# EAGLE design smart hub v2 (EAGLE 9.6.2)
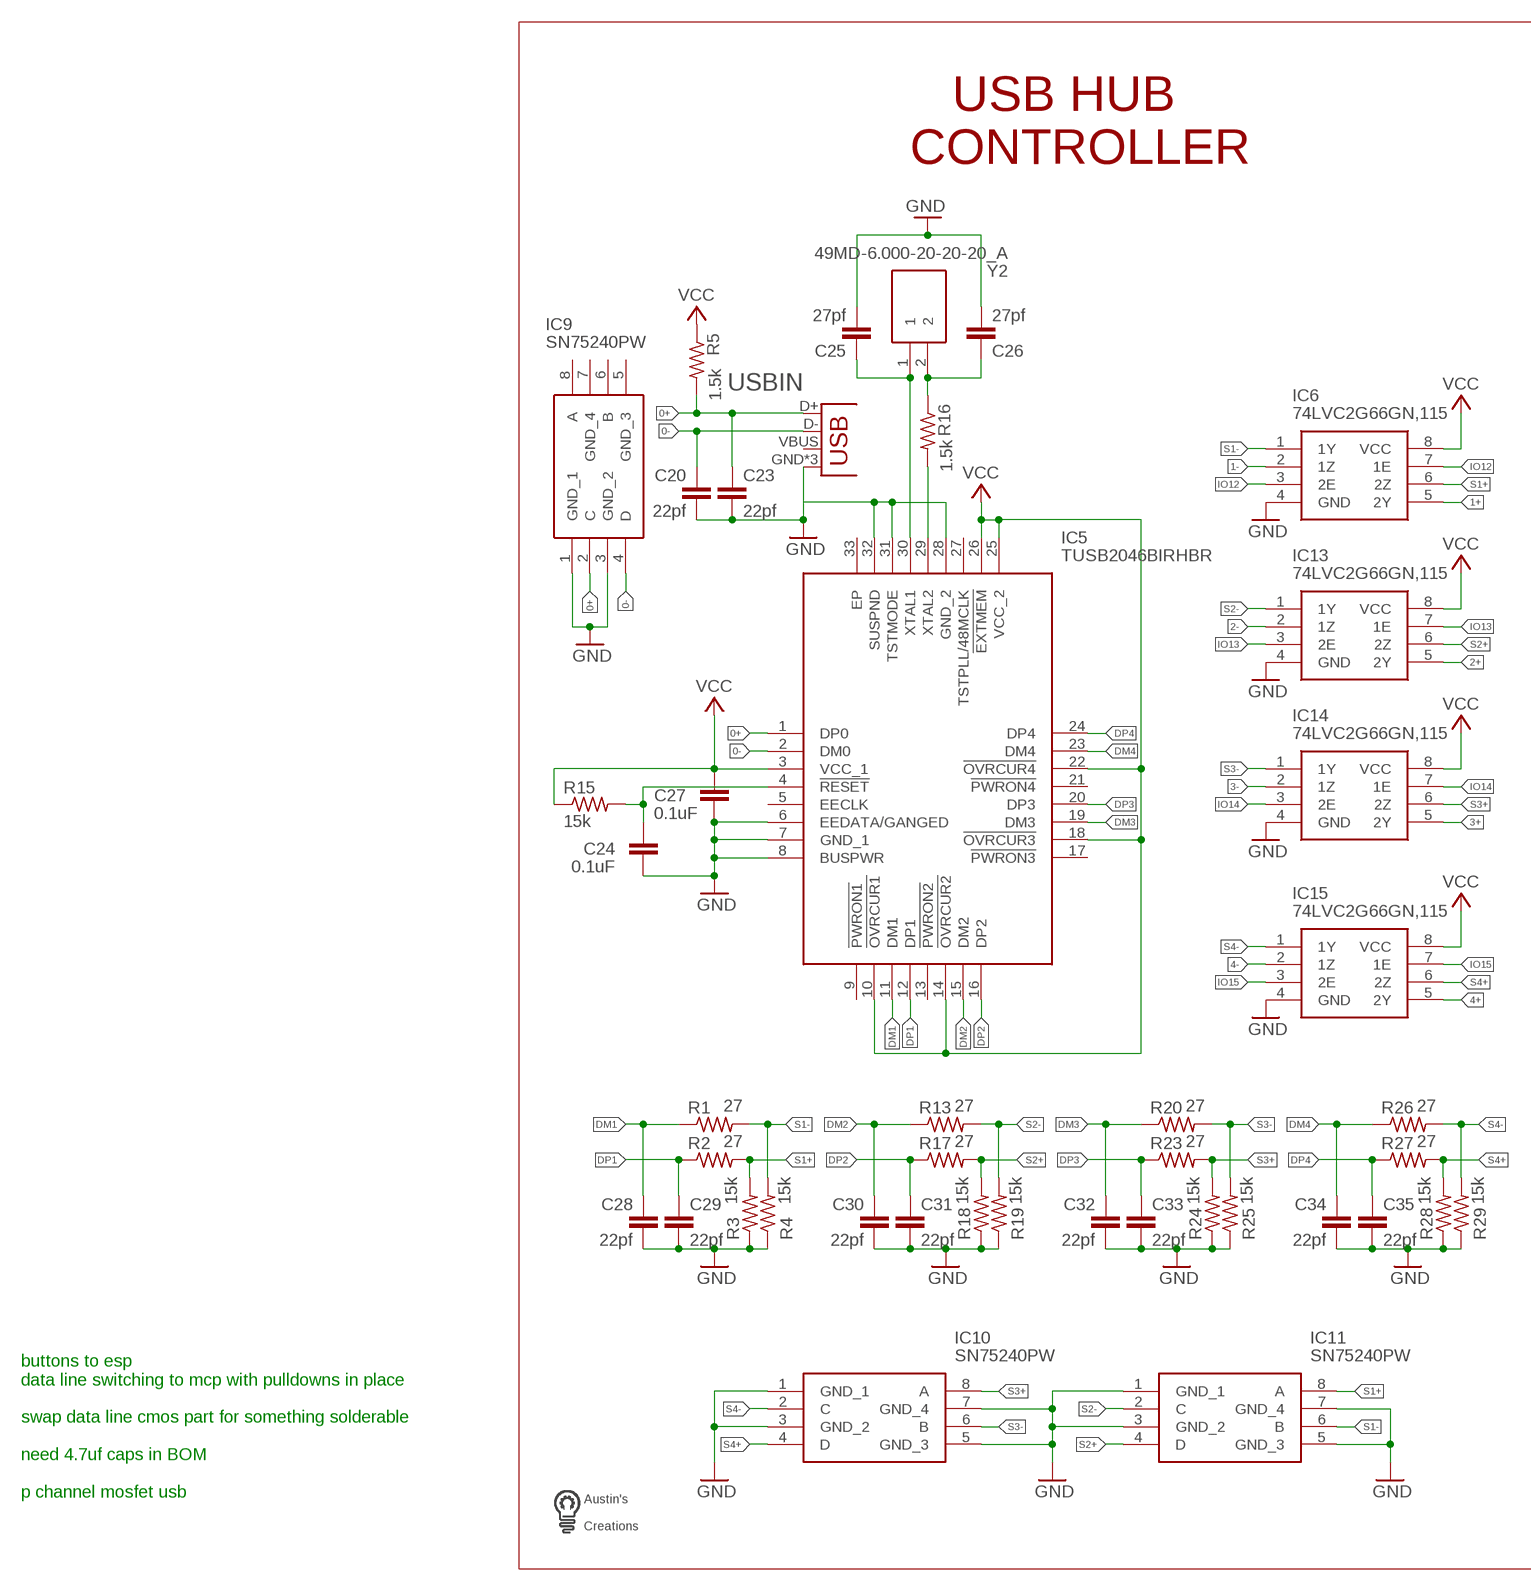
[diagram p0: schematic, sheet 1, part 1 of 2]
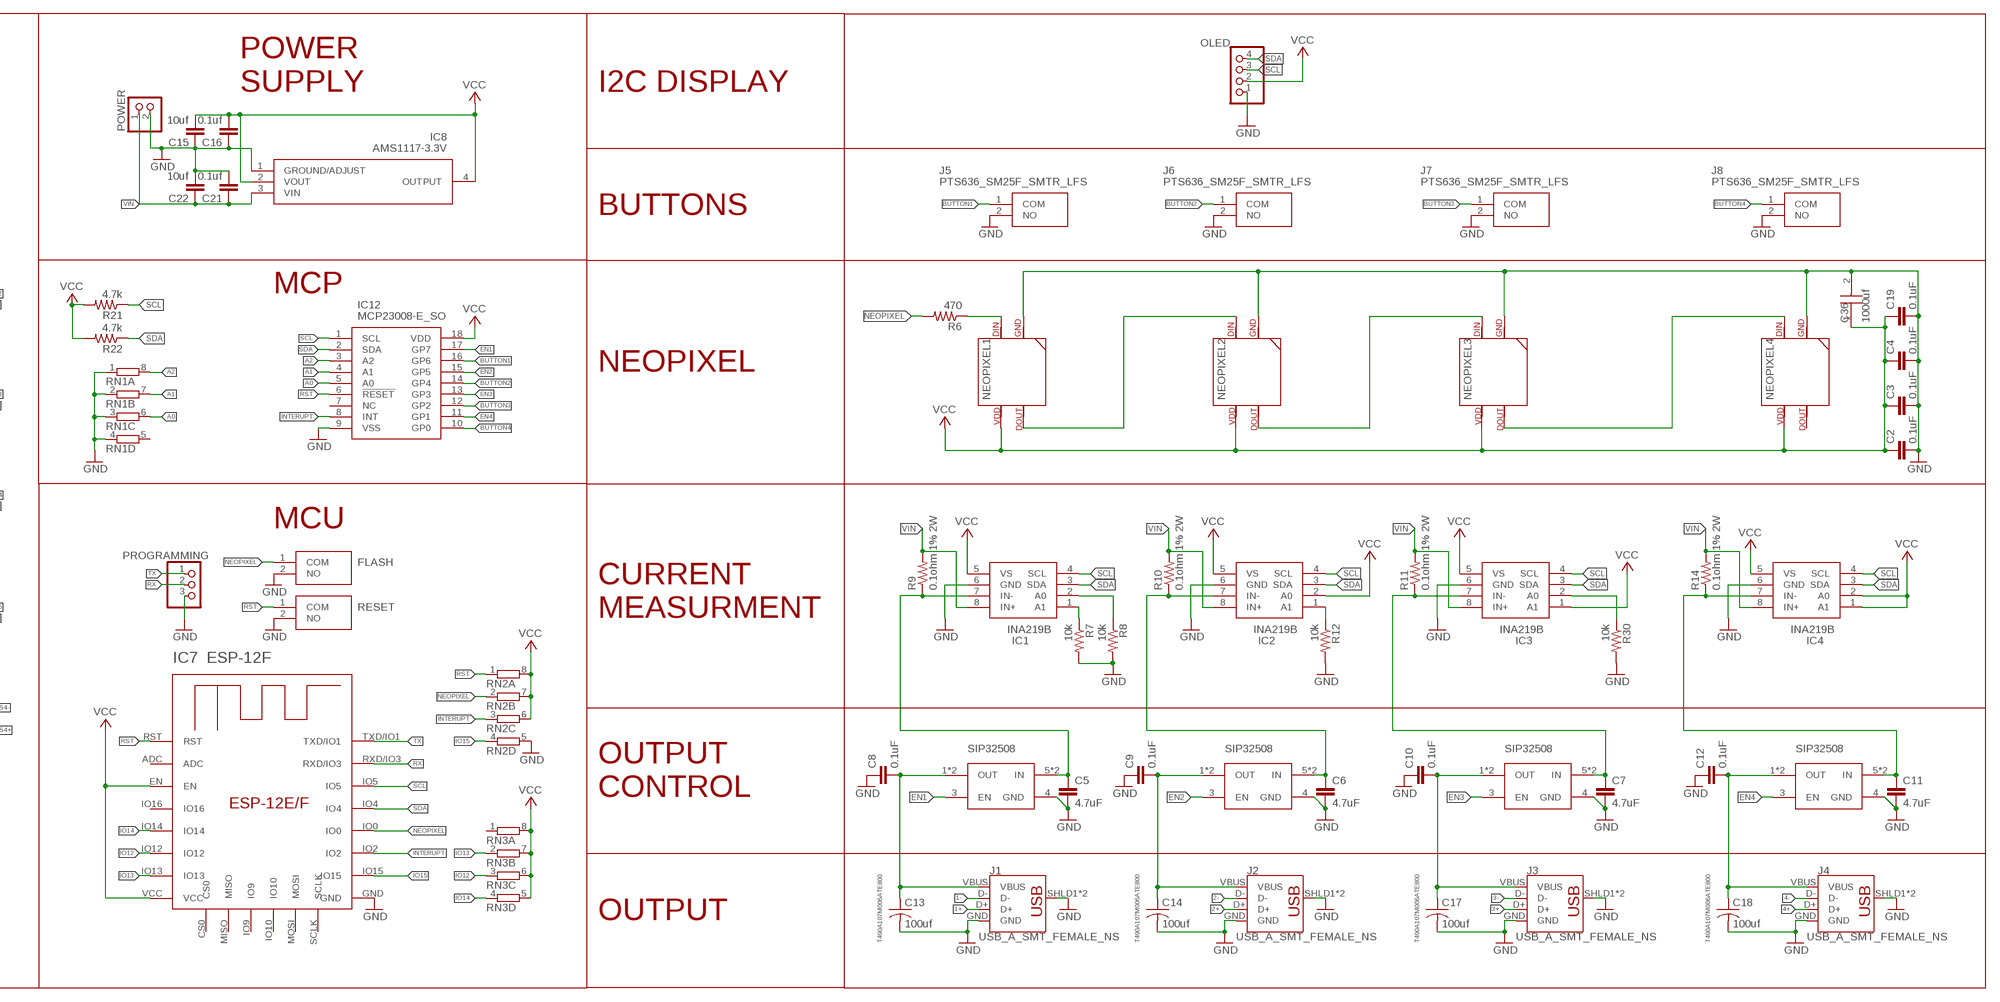
[diagram p1: schematic, sheet 1, part 2 of 2]

## Parts
C2  0.1uF  C-EUC0603  [C0603]
C3  0.1uF  C-EUC0603  [C0603]
C4  0.1uF  C-EUC0603  [C0603]
C5  4.7uF  C-EUC0603  [C0603]
C6  4.7uF  C-EUC0603  [C0603]
C7  4.7uF  C-EUC0603  [C0603]
C8  0.1uF  C-EUC0603  [C0603]
C9  0.1uF  C-EUC0603  [C0603]
C10  0.1uF  C-EUC0603  [C0603]
C11  4.7uF  C-EUC0603  [C0603]
C12  0.1uF  C-EUC0603  [C0603]
C13  100uf  C-USC1206  [C1206]
C14  100uf  C-USC1206  [C1206]
C15  10uf  C-EUC0603  [C0603]
C16  0.1uf  C-EUC0603  [C0603]
C17  100uf  C-USC1206  [C1206]
C18  100uf  C-USC1206  [C1206]
C19  0.1uF  C-EUC0603  [C0603]
C20  22pf  C-EUC0603  [C0603]
C21  0.1uf  C-EUC0603  [C0603]
C22  10uf  C-EUC0603  [C0603]
C23  22pf  C-EUC0603  [C0603]
C24  0.1uF  C-EUC0603  [C0603]
C25  27pf  C-EUC0603  [C0603]
C26  27pf  C-EUC0603  [C0603]
C27  0.1uF  C-EUC0603  [C0603]
C28  22pf  C-EUC0603  [C0603]
C29  22pf  C-EUC0603  [C0603]
C30  22pf  C-EUC0603  [C0603]
C31  22pf  C-EUC0603  [C0603]
C32  22pf  C-EUC0603  [C0603]
C33  22pf  C-EUC0603  [C0603]
C34  22pf  C-EUC0603  [C0603]
C35  22pf  C-EUC0603  [C0603]
C36  1000uf  EEE-0JA102P  [CAPAE1030X1050N]
FLASH  PTS636_SM25F_SMTR_LFS  [PTS636SM25FSMTRLFS]
IC1  INA219B  INA219AIDR  [SOIC127P600X175-8N]
IC2  INA219B  INA219AIDR  [SOIC127P600X175-8N]
IC3  INA219B  INA219AIDR  [SOIC127P600X175-8N]
IC4  INA219B  INA219AIDR  [SOIC127P600X175-8N]
IC5  TUSB2046BIRHBR  [QFN50P500X500X100-33N]
IC6  74LVC2G66GN,115  [74AUP1G74GN115]
IC7  ESP-12F  ESP-12E/F  [ESP-12E]
IC8  AMS1117-3.3V  [SOT229P700X180-4N]
IC9  SN75240PW  [SOP65P640X120-8N]
IC10  SN75240PW  [SOP65P640X120-8N]
IC11  SN75240PW  [SOP65P640X120-8N]
IC12  MCP23008-E_SO  [SOIC127P1030X265-18N]
IC13  74LVC2G66GN,115  [74AUP1G74GN115]
IC14  74LVC2G66GN,115  [74AUP1G74GN115]
IC15  74LVC2G66GN,115  [74AUP1G74GN115]
J1  USB_A_SMT_FEMALE_NS  [USB-A-S-NOSILK-FEMALE]
J2  USB_A_SMT_FEMALE_NS  [USB-A-S-NOSILK-FEMALE]
J3  USB_A_SMT_FEMALE_NS  [USB-A-S-NOSILK-FEMALE]
J4  USB_A_SMT_FEMALE_NS  [USB-A-S-NOSILK-FEMALE]
J5  PTS636_SM25F_SMTR_LFS  [PTS636SM25FSMTRLFS]
J6  PTS636_SM25F_SMTR_LFS  [PTS636SM25FSMTRLFS]
J7  PTS636_SM25F_SMTR_LFS  [PTS636SM25FSMTRLFS]
J8  PTS636_SM25F_SMTR_LFS  [PTS636SM25FSMTRLFS]
NEOPIXEL1  SK6812NEOPIXEL5050  [SK6812]
NEOPIXEL2  SK6812NEOPIXEL5050  [SK6812]
NEOPIXEL3  SK6812NEOPIXEL5050  [SK6812]
NEOPIXEL4  SK6812NEOPIXEL5050  [SK6812]
OLED  PINHD-1X4  [1X04]
POWER  PINHD-1X2  [1X02]
PROGRAMMING  PINHD-1X3  [1X03]
R1  27  R-US_R0603  [R0603]
R2  27  R-US_R0603  [R0603]
R3  15k  R-US_R0603  [R0603]
R4  15k  R-US_R0603  [R0603]
R5  1.5k  R-US_R0603  [R0603]
R6  470  R-US_R0603  [R0603]
R7  10k  R-US_R0603  [R0603]
R8  10k  R-US_R0603  [R0603]
R9  0.1ohm 1% 2W  R-US_R2512W  [R2512W]
R10  0.1ohm 1% 2W  R-US_R2512W  [R2512W]
R11  0.1ohm 1% 2W  R-US_R2512W  [R2512W]
R12  10k  R-US_R0603  [R0603]
R13  27  R-US_R0603  [R0603]
R14  0.1ohm 1% 2W  R-US_R2512W  [R2512W]
R15  15k  R-US_R0603  [R0603]
R16  1.5k  R-US_R0603  [R0603]
R17  27  R-US_R0603  [R0603]
R18  15k  R-US_R0603  [R0603]
R19  15k  R-US_R0603  [R0603]
R20  27  R-US_R0603  [R0603]
R21  4.7k  R-US_R0603  [R0603]
R22  4.7k  R-US_R0603  [R0603]
R23  27  R-US_R0603  [R0603]
R24  15k  R-US_R0603  [R0603]
R25  15k  R-US_R0603  [R0603]
R26  27  R-US_R0603  [R0603]
R27  27  R-US_R0603  [R0603]
R28  15k  R-US_R0603  [R0603]
R29  15k  R-US_R0603  [R0603]
R30  10k  R-US_R0603  [R0603]
RESET  PTS636_SM25F_SMTR_LFS  [PTS636SM25FSMTRLFS]
RN1  4R-N0603-ARC  [0603-ARC]
RN2  4R-N0603-ARC  [0603-ARC]
RN3  4R-N0603-ARC  [0603-ARC]
U$1  LOGOMASSIVE  [LOGOMASSIVE]
U$3  SIP32508  [SOT23-6]
U$4  SIP32508  [SOT23-6]
U$5  SIP32508  [SOT23-6]
U$8  SIP32508  [SOT23-6]
USBIN  USB-MICROB  [USB-MICROB]
Y2  49MD-6.000-20-20-20_A  [49MD6000202020A]

## Nets
0+: C23.1 IC5.1(DP0) IC9.2(C) R5.2 USBIN.D+
0-: C20.1 IC5.2(DM0) IC9.4(D) USBIN.D-
1+: IC6.5(2Y) J1.D+
1-: IC6.2(1Z) J1.D-
2+: IC13.5(2Y) J2.D+
2-: IC13.2(1Z) J2.D-
3+: IC14.5(2Y) J3.D+
3-: IC14.2(1Z) J3.D-
4+: IC15.5(2Y) J4.D+
4-: IC15.2(1Z) J4.D-
A0: IC12.5(A0) RN1.6
A1: IC12.4(A1) RN1.7
A2: IC12.3(A2) RN1.8
BUTTON1: IC12.16(GP6) J5.1(COM)
BUTTON2: IC12.14(GP4) J6.1(COM)
BUTTON3: IC12.12(GP2) J7.1(COM)
BUTTON4: IC12.10(GP0) J8.1(COM)
DM1: C28.1 IC5.11(DM1) R1.1
DM2: C30.1 IC5.15(DM2) R13.1
DM3: C32.1 IC5.19(DM3) R20.1
DM4: C34.1 IC5.23(DM4) R26.1
DP1: C29.1 IC5.12(DP1) R2.1
DP2: C31.1 IC5.16(DP2) R17.1
DP3: C33.1 IC5.20(DP3) R23.1
DP4: C35.1 IC5.24(DP4) R27.1
EN1: IC12.17(GP7) U$3.3(EN)
EN2: IC12.15(GP5) U$4.3(EN)
EN3: IC12.13(GP3) U$5.3(EN)
EN4: IC12.11(GP1) U$8.3(EN)
GND: C2.2 C3.2 C4.2 C5.2 C6.2 C7.2 C8.1 C9.1 C10.1 C11.2 C12.1 C13.2 C14.2 C15.1 C16.1 C17.2 C18.2 C19.2 C20.2 C21.2 C22.2 C23.2 C24.2 C25.2 C26.2 C27.2 C28.2 C29.2 C30.2 C31.2 C32.2 C33.2 C34.2 C35.2 C36.2(-) FLASH.2(NO) IC1.6(GND) IC2.6(GND) IC3.6(GND) IC4.6(GND) IC5.6(EEDATA/GANGED) IC5.7(GND_1) IC5.8(BUSPWR) IC5.28(GND_2) IC5.31(TSTMODE) IC5.32(SUSPND) IC6.4(GND) IC7.GND IC8.1(GROUND/ADJUST) IC9.1(GND_1) IC9.3(GND_2) IC10.1(GND_1) IC10.3(GND_2) IC10.5(GND_3) IC10.7(GND_4) IC11.1(GND_1) IC11.3(GND_2) IC11.5(GND_3) IC11.7(GND_4) IC12.9(VSS) IC13.4(GND) IC14.4(GND) IC15.4(GND) J1.GND J1.SHLD1(SHIELD) J1.SHLD2(SHIELD) J2.GND J2.SHLD1(SHIELD) J2.SHLD2(SHIELD) J3.GND J3.SHLD1(SHIELD) J3.SHLD2(SHIELD) J4.GND J4.SHLD1(SHIELD) J4.SHLD2(SHIELD) J5.2(NO) J6.2(NO) J7.2(NO) J8.2(NO) NEOPIXEL1.3(GND) NEOPIXEL2.3(GND) NEOPIXEL3.3(GND) NEOPIXEL4.3(GND) OLED.1 POWER.2 PROGRAMMING.3 R3.1 R4.1 R7.2 R8.2 R12.2 R18.1 R19.1 R24.1 R25.1 R28.1 R29.1 R30.2 RESET.2(NO) RN1.1 RN1.2 RN1.3 RN1.4 RN2.5 U$3.4(GND) U$4.4(GND) U$5.4(GND) U$8.4(GND) USBIN.GND USBIN.MT1(GND) USBIN.MT2(GND)
INTERUPT: IC7.IO2 IC12.8(INT) RN2.3
IO12: IC6.3(2E) IC6.7(1E) IC7.IO12 RN3.3
IO13: IC7.IO13 IC13.3(2E) IC13.7(1E) RN3.2
IO14: IC7.IO14 IC14.3(2E) IC14.7(1E) RN3.4
IO15: IC7.IO15 IC15.3(2E) IC15.7(1E) RN2.4
N$3: C25.1 IC5.30(XTAL1) Y2.1
N$4: C24.1 IC5.4(!RESET) R15.2
N$5: C26.1 R16.1 Y2.2
N$7: IC5.29(XTAL2) R16.2
N$9: NEOPIXEL1.2(DOUT) NEOPIXEL2.4(DIN)
N$10: NEOPIXEL2.2(DOUT) NEOPIXEL3.4(DIN)
N$11: C5.1 IC1.7(IN-) R9.1 U$3.5(IN) U$3.6(IN)
N$12: C6.1 IC2.7(IN-) R10.1 U$4.5(IN) U$4.6(IN)
N$13: IC3.2(A0) R30.1
N$14: IC2.1(A1) R12.1
N$15: IC1.1(A1) R7.1
N$16: IC1.2(A0) R8.1
N$17: NEOPIXEL1.4(DIN) R6.1
N$19: C7.1 IC3.7(IN-) R11.1 U$5.5(IN) U$5.6(IN)
N$20: NEOPIXEL3.2(DOUT) NEOPIXEL4.4(DIN)
N$21: C10.2 C17.1 J3.VBUS U$5.1(OUT) U$5.2(OUT)
N$22: C9.2 C14.1 J2.VBUS U$4.1(OUT) U$4.2(OUT)
N$25: C11.1 IC4.7(IN-) R14.1 U$8.5(IN) U$8.6(IN)
N$26: C12.2 C18.1 J4.VBUS U$8.1(OUT) U$8.2(OUT)
N$41: C8.2 C13.1 J1.VBUS U$3.1(OUT) U$3.2(OUT)
NEOPIXEL: FLASH.1(COM) IC7.IO0 R6.2 RN2.2
RST: IC7.RST IC12.6(!RESET) RESET.1(COM) RN2.1
RX: IC7.RXD/IO3 PROGRAMMING.2
S1+: IC6.6(2Z) IC11.8(A) R2.2 R3.2
S1-: IC6.1(1Y) IC11.6(B) R1.2 R4.2
S2+: IC11.4(D) IC13.6(2Z) R17.2 R18.2
S2-: IC11.2(C) IC13.1(1Y) R13.2 R19.2
S3+: IC10.8(A) IC14.6(2Z) R23.2 R24.2
S3-: IC10.6(B) IC14.1(1Y) R20.2 R25.2
S4+: IC10.4(D) IC15.6(2Z) R27.2 R28.2
S4-: IC10.2(C) IC15.1(1Y) R26.2 R29.2
SCL: IC1.4(SCL) IC2.4(SCL) IC3.4(SCL) IC4.4(SCL) IC7.IO5 IC12.1(SCL) OLED.3 R21.1
SDA: IC1.3(SDA) IC2.3(SDA) IC3.3(SDA) IC4.3(SDA) IC7.IO4 IC12.2(SDA) OLED.4 R22.1
TX: IC7.TXD/IO1 PROGRAMMING.1
VCC: C2.1 C3.1 C4.1 C15.2 C16.2 C19.1 C27.1 C36.1(+) IC1.5(VS) IC2.2(A0) IC2.5(VS) IC3.1(A1) IC3.5(VS) IC4.1(A1) IC4.2(A0) IC4.5(VS) IC5.3(VCC_1) IC5.10(!OVRCUR1) IC5.14(!OVRCUR2) IC5.18(!OVRCUR3) IC5.22(!OVRCUR4) IC5.25(VCC_2) IC5.26(!EXTMEM) IC6.8(VCC) IC7.EN IC7.VCC IC8.2(VOUT) IC8.4(OUTPUT) IC12.18(VDD) IC13.8(VCC) IC14.8(VCC) IC15.8(VCC) NEOPIXEL1.1(VDD) NEOPIXEL2.1(VDD) NEOPIXEL3.1(VDD) NEOPIXEL4.1(VDD) OLED.2 R5.1 R15.1 R21.2 R22.2 RN2.6 RN2.7 RN2.8 RN3.5 RN3.6 RN3.7 RN3.8
VIN: C21.1 C22.1 IC1.8(IN+) IC2.8(IN+) IC3.8(IN+) IC4.8(IN+) IC8.3(VIN) POWER.1 R9.2 R10.2 R11.2 R14.2
Unconnected: IC5.5(EECLK) IC5.9(!PWRON1) IC5.13(!PWRON2) IC5.17(!PWRON3) IC5.21(!PWRON4) IC5.27(TSTPLL/48MCLK) IC5.33(EP) IC7.ADC IC7.CS0 IC7.IO9 IC7.IO10 IC7.IO16 IC7.MISO IC7.MOSI IC7.SCLK IC9.5(GND_3) IC9.6(B) IC9.7(GND_4) IC9.8(A) IC12.7(NC) NEOPIXEL4.2(DOUT) RN1.5 RN3.1 USBIN.VBUS

## Notes on the sheet
- POWER
  SUPPLY
- I2C DISPLAY
- USB HUB
  CONTROLLER
- BUTTONS
- MCP
- NEOPIXEL
- MCU
- CURRENT
  MEASURMENT
- OUTPUT
  CONTROL
- OUTPUT
- buttons to esp
  data line switching to mcp with pulldowns in place
  
  swap data line cmos part for something solderable
  
  need 4.7uf caps in BOM
  
  p channel mosfet usb
- T490A107M006ATE800 | T490A107M006ATE800 | T490A107M006ATE800 | T490A107M006ATE800

## Library data of the parts
C2-C12 C15 C16 C19-C35 = rcl:C-EU: CAPACITOR, European symbol; SPICEPREFIX: C
C13 C14 C17 C18 = custom parts:C-US: CAPACITOR, American symbol; SPICEPREFIX: C
C36 = SamacSys_Parts:EEE-0JA102P: Panasonic 1000uF 6.3 V Aluminium Electrolytic Capacitor G, S(V) Series 2000h 10 x 10.2mm Source: Datasheet <https://componentsearchengine.com/Datasheets/1/EEE-0JA102P.pdf>; DESCRIPTION: Panasonic 1000uF 6.3 V Aluminium Electrolytic Capacitor G, S(V) Series 2000h 10 x 10.2mm; HEIGHT: 10.5mm; MANUFACTURER_NAME: Panasonic; MANUFACTURER_PART_NUMBER: EEE-0JA102P; MOUSER_PART_NUMBER: 667-EEE-0JA102P; MOUSER_PRICE-STOCK: https://www.mouser.com/Search/Refine.aspx?Keyword=667-EEE-0JA102P
FLASH J5-J8 RESET = SamacSys_Parts:PTS636_SM25F_SMTR_LFS: Tactile Switches Tact 50mA 12VDC, 6.0x3.5, 2.5mm H, 180gf, F leads, No ground pin, White Actuator Source: Datasheet <https://ms.componentsearchengine.com/Datasheets/1/PTS636 SM25F SMTR LFS.pdf>; ARROW_PART_NUMBER: PTS636 SM25F SMTR LFS; ARROW_PRICE-STOCK: https://www.arrow.com/en/products/pts636-sm25f-smtr-lfs/ck; DESCRIPTION: Tactile Switches Tact 50mA 12VDC, 6.0x3.5, 2.5mm H, 180gf, F leads, No ground pin, White Actuator; HEIGHT: 2.7mm; MANUFACTURER_NAME: C & K COMPONENTS; MANUFACTURER_PART_NUMBER: PTS636 SM25F SMTR LFS; MOUSER_PART_NUMBER: 611-PTS636SM25FSMTRL; MOUSER_PRICE-STOCK: https://www.mouser.co.uk/ProductDetail/CK/PTS636-SM25F-SMTR-LFS?qs=vLWxofP3U2wcBTQSwfMFOw%3D%3D
IC1-IC4 = SamacSys_Parts:INA219AIDR: 26-V, Bidirectional, Zero-Drift, High-Side, I2C Out Current/Power Monitor Source: Datasheet <http://www.ti.com/lit/gpn/ina219>; ARROW_PART_NUMBER: INA219AIDR; ARROW_PRICE-STOCK: https://www.arrow.com/en/products/ina219aidr/texas-instruments; DESCRIPTION: 26-V, Bidirectional, Zero-Drift, High-Side, I2C Out Current/Power Monitor; HEIGHT: 1.75mm; MANUFACTURER_NAME: Texas Instruments; MANUFACTURER_PART_NUMBER: INA219AIDR; MOUSER_PART_NUMBER: 595-INA219AIDR; MOUSER_PRICE-STOCK: https://www.mouser.co.uk/ProductDetail/Texas-Instruments/INA219AIDR?qs=XGzIaZb%2FFYIE5YcOHTnKDA%3D%3D
IC5 = SamacSys_Parts:TUSB2046BIRHBR: 4-Port USB 2.0 12 Mbps USB Full-Speed Hub Source: Datasheet <http://www.ti.com/lit/gpn/tusb2046b>; DESCRIPTION: 4-Port USB 2.0 12 Mbps USB Full-Speed Hub; HEIGHT: 1mm; MANUFACTURER_NAME: Texas Instruments; MANUFACTURER_PART_NUMBER: TUSB2046BIRHBR; MOUSER_PART_NUMBER: 595-TUSB2046BIRHBR; MOUSER_PRICE-STOCK: https://www.mouser.co.uk/ProductDetail/Texas-Instruments/TUSB2046BIRHBR?qs=0OHPnBYoB%2Fm43hGx4HiInw%3D%3D
IC6 IC13-IC15 = SamacSys_Parts:74LVC2G66GN,115: 74LVC2G66 - Bilateral switch@en-us Source: Datasheet <https://assets.nexperia.com/documents/data-sheet/74LVC2G66.pdf>; DESCRIPTION: 74LVC2G66 - Bilateral switch@en-us; HEIGHT: 0.35mm; MANUFACTURER_NAME: Nexperia; MANUFACTURER_PART_NUMBER: 74LVC2G66GN,115; MOUSER_PART_NUMBER: 771-74LVC2G66GN115; MOUSER_PRICE-STOCK: https://www.mouser.co.uk/ProductDetail/Nexperia/74LVC2G66GN115?qs=vLWxofP3U2z2XqCRYjsqFg%3D%3D
IC7 = custom parts:ESP-12E/F
IC8 = SamacSys_Parts:AMS1117-3.3V: 1A LOW DROPOUT VOLTAGE REGULATOR, SOT-223 Source: Datasheet <http://www.advanced-monolithic.com/pdf/ds1117.pdf>; DESCRIPTION: 1A LOW DROPOUT VOLTAGE REGULATOR, SOT-223; HEIGHT: 1.8mm; MANUFACTURER_NAME: Advanced Monolithic Systems; MANUFACTURER_PART_NUMBER: ams1117-3.3v
IC9-IC11 = SamacSys_Parts:SN75240PW: Dual USB Port Transient Suppressor Source: Datasheet; DESCRIPTION: Dual USB Port Transient Suppressor; HEIGHT: 1.2mm; MANUFACTURER_NAME: Texas Instruments; MANUFACTURER_PART_NUMBER: SN75240PW; MOUSER_PART_NUMBER: 595-SN75240PW; MOUSER_PRICE-STOCK: https://www.mouser.co.uk/ProductDetail/Texas-Instruments/SN75240PW?qs=q2XTDbzbm6CHHo1l5fz%2Fyw%3D%3D
IC12 = SamacSys_Parts:MCP23008-E_SO: 8-bit I/O Expander,I2C,MCP23008-E/SO Source: Datasheet <http://docs-emea.rs-online.com/webdocs/0a78/0900766b80a784b7.pdf>; ARROW_PART_NUMBER: MCP23008-E/SO; ARROW_PRICE-STOCK: https://www.arrow.com/en/products/mcp23008-eso/microchip-technology; DESCRIPTION: 8-bit I/O Expander,I2C,MCP23008-E/SO; HEIGHT: 2.65mm; MANUFACTURER_NAME: Microchip; MANUFACTURER_PART_NUMBER: MCP23008-E/SO; MOUSER_PART_NUMBER: 579-MCP23008-E/SO; MOUSER_PRICE-STOCK: https://www.mouser.co.uk/ProductDetail/Microchip-Technology/MCP23008-E-SO?qs=Sez7gRs8XSWum74ZwQXTLw%3D%3D
J1-J4 = custom parts:USB_A: USB-A Connector Male and female variants, as well as PTH and SMT variants SparkFun Products: SparkFun XBee Explorer Dongle <https://www.sparkfun.com/products/11697> PTH Male SparkFun MicroView-USB Programmer <https://www.sparkfun.com/products/12924> SMT Male SparkFun USB Type A Female Breakout <https://www.sparkfun.com/products/12700> SMT Female; PROD_ID: CONN-09520; SF_ID: PRT-09011
NEOPIXEL1-NEOPIXEL4 = custom parts:SK6812: for 5050 sk6812 LED
OLED = custom parts:PINHD-1X4: PIN HEADER
POWER = pinhead:PINHD-1X2: PIN HEADER
PROGRAMMING = custom parts:PINHD-1X3: PIN HEADER
R1-R30 = rcl:R-US_: RESISTOR, American symbol; SPICEPREFIX: R
RN1-RN3 = custom parts:4R-N: Array Chip Resistor Source: RS Component / Phycomp; OC_FARNELL: unknown; OC_NEWARK: unknown
U$1 = custom parts:LOGOMASSIVE
U$3-U$5 U$8 = custom parts:SIP32508: SiP32508 high side driver, 5v 3A
USBIN = custom parts:USB: USB Connectors USB-B-PTH is fully proven SKU : PRT-00139/CONN-08278 USB-miniB is fully proven SKU : PRT-00587 USB-A-PCB is untested. USB-A-H is throughly reviewed, but untested. Spark Fun Electronics SKU : PRT-00437 USB-B-SMT is throughly reviewed, but untested. Needs silkscreen touching up. USB-A-S has not been used/tested USB-MB-H has not been used/tested USB-MICROB has been used. CONN-09505; PROD_ID: CONN-09505
Y2 = SamacSys_Parts:49MD-6.000-20-20-20_A: 12.5 x 4.5 Crystal Source: Datasheet <https://datasheet.lcsc.com/szlcsc/Suzhou-Liming-Elec-49MD-6-000-20-20-20-A_C240973.pdf>; DESCRIPTION: 12.5 x 4.5 Crystal; HEIGHT: 4.2mm; MANUFACTURER_NAME: LIMING; MANUFACTURER_PART_NUMBER: 49MD-6.000-20-20-20/A

## Board
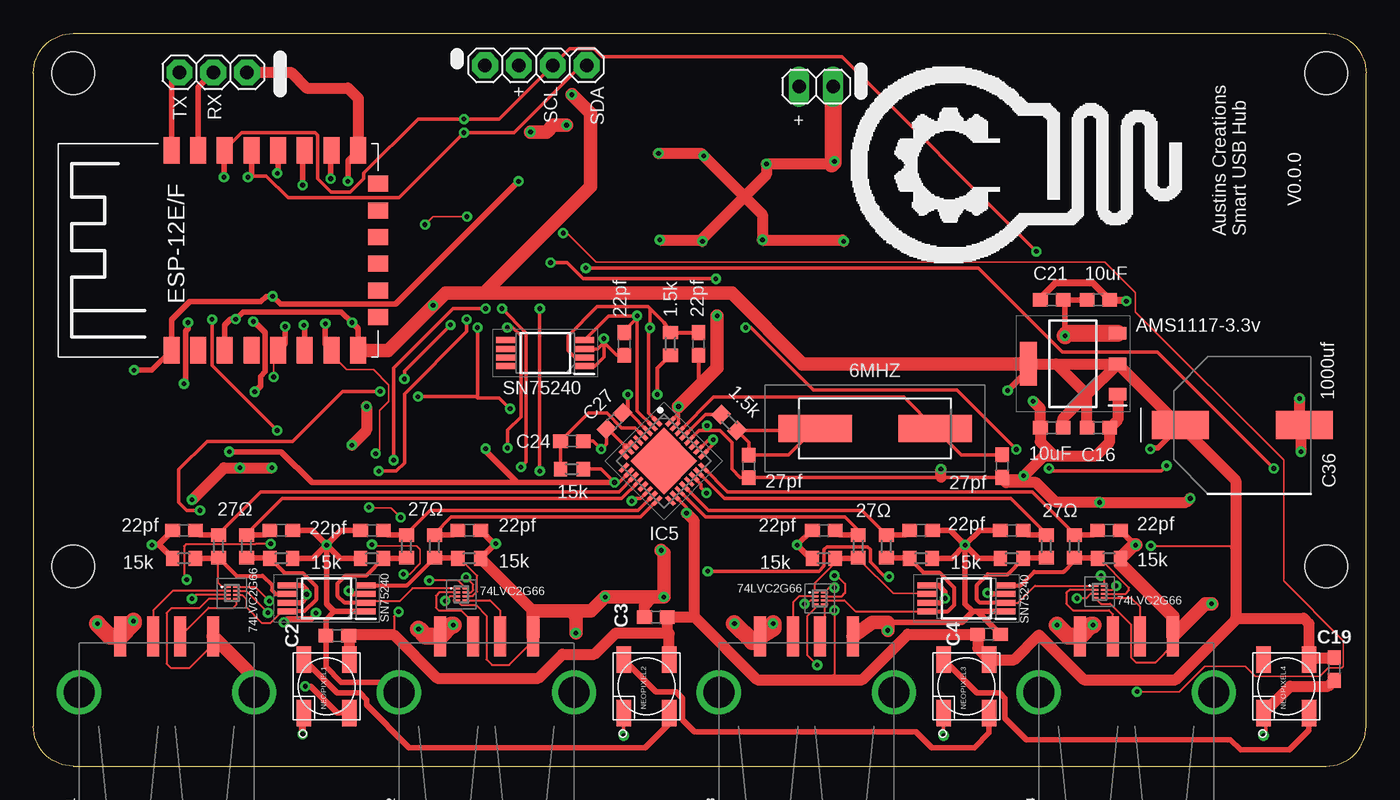
[diagram p2: board, top side]
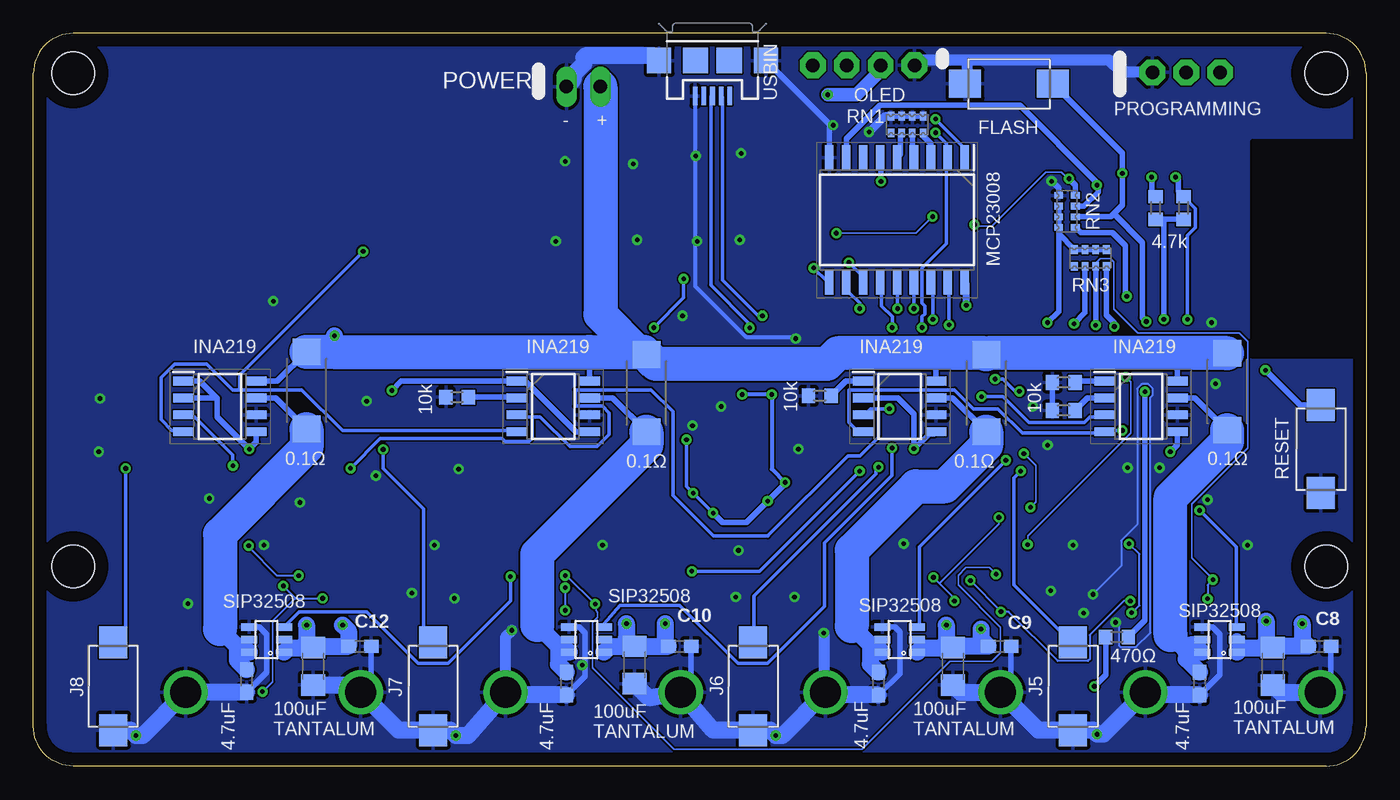
[diagram p3: board, bottom side, seen from below]

Size 100 x 55 mm. Coordinates in mm from the lower left corner, seen from the top.
Outline: 3,0 97,0 arc90 100,3 100,52 arc90 97,55 3,55 arc90 0,52 0,3 arc90 3,0
Copper layers (1*16): Top 0.035mm / dielectric 1.5mm / Bottom 0.035mm
Design rules "default *": minimum track width 5mil, minimum drill 0.35mm, track to track 5mil, track to pad 5mil, pad to pad 5mil, via to via 5mil, smd to smd 5mil, copper to edge 40mil, drill to drill 6mil, minimum pad ring 10mil, minimum via ring 8mil, stop-mask expansion 4mil, vias tented up to drill 0mil, thermal gap 10mil
Holes 3.2 mm at 3,15 97,15 3,52 97,52
tRestrict: area 0.3,30.8 to 8.5,46.9
bRestrict: area 0.3,30.8 to 8.5,46.9

### Footprints (pad centres in the part's own frame; a part is rotated, then mirrored left to right if it is on the bottom)
C0603 = smd 1.1 x 1: 1 -0.85,0; 2 0.85,0
C1206 = smd 1.6 x 1.8: 1 -1.4,0; 2 1.4,0
CAPAE1030X1050N = smd 4.3 x 2.1: 1 -4.65,0; 2 4.65,0
PTS636SM25FSMTRLFS = smd 2.4 x 2.1: 1 -3.3,0; 2 3.3,0
SOIC127P600X175-8N = smd 1.55 x 0.65: 1 -2.725,1.905; 2 -2.725,0.635; 3 -2.725,-0.635; 4 -2.725,-1.905; 5 2.725,-1.905; 6 2.725,-0.635; 7 2.725,0.635; 8 2.725,1.905
QFN50P500X500X100-33N = smd 0.85 x 0.3: 1 -2.45,1.75; 2 -2.45,1.25; 3 -2.45,0.75; 4 -2.45,0.25; 5 -2.45,-0.25; 6 -2.45,-0.75; 7 -2.45,-1.25; 8 -2.45,-1.75; 17 2.45,-1.75; 18 2.45,-1.25; 19 2.45,-0.75; 20 2.45,-0.25; 21 2.45,0.25; 22 2.45,0.75; 23 2.45,1.25; 24 2.45,1.75 | smd 0.3 x 0.85: 9 -1.75,-2.45; 10 -1.25,-2.45; 11 -0.75,-2.45; 12 -0.25,-2.45; 13 0.25,-2.45; 14 0.75,-2.45; 15 1.25,-2.45; 16 1.75,-2.45; 25 1.75,2.45; 26 1.25,2.45; 27 0.75,2.45; 28 0.25,2.45; 29 -0.25,2.45; 30 -0.75,2.45; 31 -1.25,2.45; 32 -1.75,2.45 | smd 3.55 x 3.55: 33 0,0
74AUP1G74GN115 = smd 0.15 x 0.5: 1 -0.45,-0.35; 2 -0.15,-0.35; 3 0.15,-0.35; 4 0.45,-0.35; 5 0.45,0.35; 6 0.15,0.35; 7 -0.15,0.35; 8 -0.45,0.35
ESP-12E = smd 2 x 1.2: ADC -7.46,5.53; EN -7.46,3.53; GND 7.54,-6.47; IO0 7.54,-0.47; IO2 7.54,-2.47; IO4 7.54,1.53; IO5 7.54,3.53; IO12 -7.46,-2.47; IO13 -7.46,-4.47; IO14 -7.46,-0.47; IO15 7.54,-4.47; IO16 -7.46,1.53; RST -7.46,7.53; RXD/IO3 7.54,5.53; TXD/IO1 7.54,7.53; VCC -7.46,-6.47 | smd 1.2 x 1.5: CS0 -4.96,-7.97; IO9 -0.96,-7.97; IO10 1.04,-7.97; MISO -2.96,-7.97; MOSI 3.04,-7.97; SCLK 5.04,-7.97
SOT229P700X180-4N = smd 1.3 x 0.95: 1 -3.35,2.29; 2 -3.35,0; 3 -3.35,-2.29 | smd 1.3 x 3.25: 4 3.35,0
SOP65P640X120-8N = smd 1.475 x 0.45: 1 -2.938,0.975; 2 -2.938,0.325; 3 -2.938,-0.325; 4 -2.938,-0.975; 5 2.938,-0.975; 6 2.938,-0.325; 7 2.938,0.325; 8 2.938,0.975
SOIC127P1030X265-18N = smd 1.85 x 0.65: 1 -4.675,5.08; 2 -4.675,3.81; 3 -4.675,2.54; 4 -4.675,1.27; 5 -4.675,0; 6 -4.675,-1.27; 7 -4.675,-2.54; 8 -4.675,-3.81; 9 -4.675,-5.08; 10 4.675,-5.08; 11 4.675,-3.81; 12 4.675,-2.54; 13 4.675,-1.27; 14 4.675,0; 15 4.675,1.27; 16 4.675,2.54; 17 4.675,3.81; 18 4.675,5.08
USB-A-S-NOSILK-FEMALE = smd 3 x 0.9: D+ 6.752,-1; D- 6.752,1; GND 6.752,-3.5; VBUS 6.752,3.5 | drill 2.311: SHLD1 2.54,-6.566; SHLD2 2.54,6.566
SK6812 = smd 2 x 1.1: 1 -2,1.7; 2 -2,-1.7; 3 2,-1.7; 4 2,1.7
1X04 = drill 1.016 pad 1.93 octagon: 1 -3.81,0; 2 -1.27,0; 3 1.27,0; 4 3.81,0
1X02 = drill 1.016 long: 1 -1.27,0; 2 1.27,0
1X03 = drill 1.016 pad 1.93 octagon: 1 -2.54,0; 2 0,0; 3 2.54,0
R0603 = smd 1 x 1.1: 1 -0.85,0; 2 0.85,0
R2512W = smd 2 x 2.1: 1 -2.896,0; 2 2.896,0
0603-ARC = smd 0.5 x 0.65: 1 -1.2,-0.625; 2 -0.4,-0.625; 3 0.4,-0.625; 4 1.2,-0.625; 5 1.2,0.625; 6 0.4,0.625; 7 -0.4,0.625; 8 -1.2,0.625
SOT23-6 = smd 0.55 x 1.2: 1 -0.95,-1.3; 2 0,-1.3; 3 0.95,-1.3; 4 0.95,1.3; 5 0,1.3; 6 -0.95,1.3
USB-MICROB = smd 0.35 x 1.4: D+ 0,2.65; D- -0.65,2.65; GND 1.3,2.65; ID 0.65,2.65; VBUS -1.3,2.65 | smd 1.8 x 1.9: MT1 -4,0; MT2 4,0 | smd 1.9 x 1.9: P$1 -1.27,0; P$2 1.27,0
49MD6000202020A = smd 5.5 x 2: 1 -4.5,0; 2 4.5,0

### Placement (x,y rotation side)
C2  22.8,9.8 180 top
C3  46.7,11.2 180 top
C4  71.7,9.9 0 top
C5  12.5,6.2 270 bottom
C6  36.6,6.2 270 bottom
C7  60,6.2 270 bottom
C8  3.5,9 180 bottom
C9  27.5,9 180 bottom
C10  51.5,9 180 bottom
C11  84,6.4 270 bottom
C12  75.5,9 180 bottom
C13  7,7.5 270 bottom
C14  31,7.5 270 bottom
C15  76.4,25.4 0 top
C16  79.9,25.4 180 top
C17  54.9,7.6 270 bottom
C18  79,7.5 270 bottom
C19  97.6,7.3 270 top
C20  44.33,31.7 270 top
C21  76.4,35 180 top
C22  79.9,35 0 top
C23  49.9,31.7 270 top
C24  40.4,24.4 0 top
C25  72.68,22.52 270 top
C26  53.68,22.5 270 top
C27  43.6,25.9 225 top
C28  11.3,17.7 180 top
C29  18.6,17.7 0 top
C30  25.4,17.7 180 top
C31  32.7,17.7 0 top
C32  59.3,17.7 180 top
C33  66.6,17.7 0 top
C34  73.4,17.7 180 top
C35  80.7,17.7 0 top
C36  90.7,25.6 0 top
FLASH  26.8,51.21 180 bottom
IC1  16.9,27 0 bottom
IC2  35,27 0 bottom
IC3  61,27 0 bottom
IC4  86,27 0 bottom
IC5  47.3,22.9 315 top
IC6  14.9,13 270 top
IC7  17.9,38.67 90 top
IC8  78,30.2 180 top
IC9  38.4,31 180 top
IC10  70,12.6 180 top
IC11  22,12.6 180 top
IC12  35.2,41 270 bottom
IC13  32.1,12.9 270 top
IC14  59,12.6 270 top
IC15  80,13.1 270 top
J1  10,3 90 top
J2  34,3 90 top
J3  58,3 90 top
J4  82,3 90 top
J5  22,6 270 bottom
J6  46,6 270 bottom
J7  70,6 270 bottom
J8  94,6 270 bottom
NEOPIXEL1  22,6 270 top
NEOPIXEL2  46,6 270 top
NEOPIXEL3  70,6 270 top
NEOPIXEL4  94,6 270 top
OLED  37.7,52.6 0 top
POWER  58.73,51 0 top
PROGRAMMING  13.5,52.07 0 top
R1  13.9,16.5 270 top
R2  16,16.5 270 top
R3  18.6,15.6 180 top
R4  11.3,15.6 0 top
R5  47.8,31.7 90 top
R6  18.7,9.7 0 bottom
R7  22.7,28.8 180 bottom
R8  22.7,26.7 180 bottom
R9  10.43,28.1 90 bottom
R10  28.5,28 90 bottom
R11  54,28 90 bottom
R12  41,27.8 180 bottom
R13  28,16.5 270 top
R14  79.5,28.2 90 bottom
R15  40.4,22.3 180 top
R16  52.2,25.8 135 top
R17  30.1,16.5 270 top
R18  32.7,15.6 180 top
R19  25.4,15.6 0 top
R20  61.9,16.5 270 top
R21  13.7,41.9 270 bottom
R22  15.8,41.9 270 bottom
R23  64,16.5 270 top
R24  66.6,15.6 180 top
R25  59.3,15.6 0 top
R26  76,16.5 270 top
R27  78.1,16.5 270 top
R28  80.7,15.6 180 top
R29  73.4,15.6 0 top
R30  68.2,27.7 180 bottom
RESET  3.39,23.8 270 bottom
RN1  34.45,48.15 180 bottom
RN2  22.45,41.63 90 bottom
RN3  20.69,38.15 0 bottom
U$1  86.1,37.8 90 top
U$3  11,9.5 90 bottom
U$4  35,9.5 90 bottom
U$5  58.5,9.5 90 bottom
U$8  82.5,9.5 90 bottom
USBIN  49.05,52.95 180 bottom
Y2  63.16,25.35 180 top

### Tracks (layer width: path | path; a pad name or v marks a point on that pad's centre or on a via)
0+  (via drill 0.35)
  Top 0.254: IC5.1 46.16,26.52 46.16,32.9 v46.26,32.9 46.26,34.34 | IC9.2 40.62,30.68 40.1,31.2 40.1,32.3 42.3,34.5 46.1,34.5 46.26,34.34 | R5.2 47.3,33.3 46.26,34.34
  Top 0.305: R5.2 C23.1
  Bottom 0.254: v46.26,32.9 46.26,33.2 49.16,36.1 49.16,50.29 49.15,50.3 USBIN.D+
0-  (via drill 0.35)
  Top 0.254: v45.3,33.8 45.3,26.67 IC5.2 | IC9.4 43.16,33.8 v45.3,33.8 | C20.1 44.33,32.65 45.3,33.62 v45.3,33.8
  Bottom 0.254: USBIN.D- 48.3,50.2 48.3,36.5 45.6,33.8 v45.3,33.8
1+
  Top 0.152: J1.D+ 13.15,11.9 15,11.9 15.25,12.15 IC6.5
1-
  Top 0.152: IC6.2 10.45,13.15 9,11.7 J1.D-
2+
  Top 0.152: IC13.5 34.25,12.45 35,11.7 J2.D+
2-
  Top 0.152: IC13.2 30.45,13.05 30.2,12.8 30.2,11.9 30.4,11.7 32.1,11.7 33,10.8 J2.D-
3+
  Top 0.152: IC14.5 59.35,9.7 J3.D+
3-
  Top 0.152: IC14.2 57.45,12.75 57,12.3 J3.D-
4+
  Top 0.152: IC15.5 82.35,12.65 83,12 J4.D+
4-
  Top 0.152: J4.D- 81,11.4 80.7,11.7 78,11.7 77.5,12.2 77.5,13 77.75,13.25 IC15.2
A0
  Bottom 0.406: RN1.6 34.95,47.42 34.95,45.92 IC12.5
A1
  Bottom 0.406: RN1.7 34.05,45.8 IC12.4
A2
  Bottom 0.406: RN1.8 33.25,47.33 32.66,46.73 IC12.3
BUTTON1  (via drill 0.35)
  Top 0.254: v32.51,33.53 32.51,32.6 27.84,27.93 27.84,22.76 27.23,22.15 v25.92,22.15
  Bottom 0.254: v32.51,33.53 32.51,36.17 IC12.16 | v25.92,22.15 26.42,21.65 26.42,13.61 22.15,9.35 J5.1
BUTTON2  (via drill 0.35)
  Top 0.254: v35.15,34.34 36.98,32.51 36.98,22.85 v36.58,22.45
  Bottom 0.254: v35.15,34.34 35.15,36.17 IC12.14 | v36.58,22.45 36.78,22.25 36.78,21.93 45.92,12.79 45.92,9.35 J6.1
BUTTON3  (via drill 0.35)
  Top 0.254: v38.81,37.8 40.03,37.8 41.25,36.58 v51.21,36.58 | v53.44,32.92 53.85,32.92 58.52,28.25 69.29,28.25 v73.76,23.77
  Bottom 0.254: v38.81,37.8 37.8,36.78 37.8,36.37 IC12.12 | v51.21,36.58 51.21,35.15 v53.44,32.92 | v73.76,23.77 73.76,22.35 70.71,19.3 70.71,9.96 70.1,9.35 J7.1
BUTTON4  (via drill 0.35)
  Top 0.254: v41.45,37.39 70.92,37.39 77.22,31.09 84.33,31.09 v93.07,22.35
  Bottom 0.254: v41.45,37.39 40.44,36.37 IC12.10 | v93.07,22.35 93.07,10.15 93.88,9.35 J8.1
DM1
  Top 0.254: R1.1 13.9,17.45 17.05,20.6 43.94,20.6 IC5.11
  Top 0.406: R1.1 12.5,17.35 C28.1
DM2
  Top 0.254: R13.1 28,17.45 29.75,19.2 45.37,19.2 IC5.15
  Top 0.406: R13.1 26.6,17.35 C30.1
DM3
  Top 0.254: R20.1 61.9,17.7 60.9,18.7 50.44,18.7 IC5.19
  Top 0.406: R20.1 60.5,17.35 C32.1
DM4
  Top 0.254: R26.1 76,17.45 73.35,20.1 51.87,20.1 IC5.23
  Top 0.406: R26.1 74.6,17.35 C34.1
DP1
  Top 0.254: R2.1 16,17.45 18.65,20.1 44.15,20.1 IC5.12
  Top 0.406: R2.1 17.4,17.35 C29.1
DP2
  Top 0.254: R17.1 30.1,17.45 31.35,18.7 45.58,18.7 IC5.16
  Top 0.406: C31.1 31.5,17.35 R17.1
DP3
  Top 0.254: R23.1 62.15,19.2 50.65,19.2 IC5.20
  Top 0.406: C33.1 65.4,17.35 R23.1
DP4
  Top 0.254: R27.1 78.1,17.45 74.95,20.6 52.08,20.6 IC5.24
  Top 0.406: R27.1 79.5,17.35 C35.1
EN1  (via drill 0.35)
  Top 0.254: v12.5,19.2 11.5,19.2 10.9,19.8 10.9,22.25 13.03,24.38 19.46,24.38 23.21,28.13 v26.01,28.13 | v27.84,29.06 27.84,29.67 v31.29,33.12
  Bottom 0.254: v12.5,19.2 9.75,16.45 9.75,10.57 U$3.3 | v27.84,29.06 27.24,29.06 26.31,28.13 v26.01,28.13 | v31.29,33.12 31.29,36.17 IC12.17
EN2  (via drill 0.35)
  Top 0.254: v27.03,22.96 27.03,29.87 31.5,34.34 v33.93,34.34
  Bottom 0.254: v27.03,22.96 33.53,16.46 33.53,10.57 U$4.3 | v33.93,34.34 33.93,36.17 IC12.15
EN3  (via drill 0.35)
  Top 0.254: v35.57,23.88 35.57,25.21 36.58,26.22 36.58,32.31 35.97,32.92 v35.56,32.92
  Bottom 0.254: v35.57,23.88 35.57,21.83 40.63,16.77 40.63,11.99 44.91,7.72 47.14,7.72 51.51,12.09 55.98,12.09 57.2,10.68 U$5.3 | v35.56,32.92 35.56,33.73 36.37,34.54 36.37,36.17 IC12.13
EN4  (via drill 0.35)
  Top 0.254: v64.2,14.22 63.91,14.22 62.79,15.34 62.79,16.26 62.59,16.46 59.54,16.46 59.33,16.26 59.33,15.04 58.93,14.63 v50.6,14.63 | v38,34.34 v38,22.15
  Bottom 0.254: v64.2,14.22 64.2,12.4 68.89,7.72 71.12,7.72 74.98,11.58 80.06,11.58 81.08,10.57 U$8.3 | v50.6,14.63 45.52,14.63 v38,22.15 | v38,34.34 38,34.75 38.81,35.56 38.81,36.17 IC12.11
GND  (via drill 0.35)
  Top 0.152: IC13.4 32.1,12.1 33.2,12.1 34,11.3 34,8.02 34.41,7.6 35.7,7.6 37.5,9.4 J2.GND | IC6.4 13.15,12.55 12.45,11.85 10.35,11.85 10,11.5 10,7.7 10.3,7.4 11.75,7.4 13.5,9.15 J1.GND | IC14.4 58.65,11.85 58.05,11.25 58.05,8.35 v58.81,7.59 | IC15.4 80.1,12.2 80.79,12.2 82.35,10.64 82.35,8.17 82.72,7.8 84.2,7.8 85.5,9.1 J4.GND
  Top 0.254: IC5.7 44.33,24.1 | 44.33,24.1 43.13,25.3 C27.2 43,24.2 v42.6,23.8 42,24.4 C24.2 | IC5.6 44.33,24.1 | IC5.8 44.33,24.1 | 42.8,31.8 v42.8,32.1 42.8,30.7 42.12,30.02 IC9.1 | 42.8,31.8 42.33,31.32 IC9.3 | IC5.32 48.4,26.48 | 48.4,26.48 v48.4,27 | IC5.31 48.4,25.77 48.4,26.48 | C26.2 53.7,21.67 | 53.7,21.67 68.1,21.67 72.6,21.67 C25.2 72.81,21.8 v74.3,21.8 | C20.2 43.75,30.85 42.8,31.8 | 53.7,21.67 53.03,21.67 52.4,22.3 52.4,24.3 51.5,25.2 50.2,25.2 | IC5.28 49.95,25.2 50.2,25.2 | 20.32,3.86 NEOPIXEL1.3 | NEOPIXEL2.3 44.3,3.86 44.3,2.44 v44.3,2.3 | NEOPIXEL3.3 68.28,3.86 68.28,2.44 v68.3,2.3 | NEOPIXEL4.3 92.46,3.66 92.46,2.44 v92.3,2.3 | 50.2,25.2 50.54,25.54 v50.54,25.56
  Top 0.305: C23.2 49.9,28.5
  Top 0.406: IC11.7 20.07,12.28 20.5,12.7 v20.5,12.9 20.5,13.2 20.12,13.57 IC11.5 | IC11.3 23.91,12.93 v23.67,13.17 | IC10.7 68.08,12.28 v68.4,12.6 68.4,13.1 67.92,13.57 IC10.5 | IC10.3 71.67,12.93 v71.6,13 | C29.2 20.9,17.7 v22,16.6 | v22,16.6 23.1,17.7 C30.2 | R19.1 23,15.6 v22,16.6 | R3.1 21,15.6 v22,16.6 | C28.2 9.35,16.6 v8.9,16.6 9.45,16.6 R4.1 | R18.1 34.65,16.7 | 34.65,16.7 v34.7,16.7 | C33.2 68.8,17.7 v69.9,16.6 | R24.1 68.9,15.6 v69.9,16.6 | R29.1 70.9,15.6 v69.9,16.6 | C34.2 71,17.7 v69.9,16.6 | R25.1 58.3,15.6 v57.3,16.6 58.4,17.7 C32.2 | 82.55,16.6 v82.7,16.6 | C35.2 82.65,16.6 | C31.2 34.55,16.7 34.65,16.7 | IC10.1 70.83,11.62 | v69.9,16.6 69.9,12.2 70.47,11.62 | IC11.1 22.57,11.62 | v22,16.6 22,12.2 22.57,11.62 | 70.47,11.62 69.65,10.8 64.1,10.8 | IC7.GND 23.6,45.44 v23.6,43.9 | v11.6,33.3 11.6,32.84 11.41,32.66 11.41,28.81 v11.3,28.7 | 22.57,11.62 21.95,11 C2.2 21.95,7.45 23.1,6.3 26.67,6.3 J2.SHLD2 | C4.2 70.83,11.62 | 70.83,11.62 70.47,11.62 | v18.8,10.8 19.07,11.07 20.85,11.07 21.2,11.42 v21.2,11.5
  Top 0.508: C21.2 75.55,35.15 76.7,36.3 79.45,36.3 C22.2 81.9,35 v82,34.9 | v20.2,2.4 20.2,3.9 NEOPIXEL1.3
  Top 0.813: IC8.1 81.35,26 C16.1 80.75,24.35 79.7,23.3 76.6,23.3 | 76.6,23.3 75.55,24.35 C15.1 75.55,26.85 v75,27.4 | v74.3,21.8 75.8,23.3 76.6,23.3 | v95,27.6 95,25.95 C36.2 95.1,25.35 v95.1,23.6 | NEOPIXEL4.3 94.3,6 97.15,6 C19.2 | R18.1 37.5,11.65 | PROGRAMMING.3 19.33,52.07 20.5,50.9 23.6,50.9 24.37,50.13 IC7.GND | v11.9,20 14.3,22.4 v15.5,22.4 v17.9,22.4 | v86.8,20.1 86.5,19.8 v80,19.8 76.72,19.8 75.23,21.29 72.98,21.29 72.6,21.67 | 68.1,21.67 v68.1,22.3 | v46.9,46 50.1,46 v50.3,45.8 54.7,41.4 v54.7,39.5 60.7,39.5 v60.8,39.4 | v47,39.5 50.1,39.5 | 50.1,39.5 v50.2,39.4 | v60.1,45.4 59.9,45.2 v55,45.2 55,44.4 50.1,39.5 | C3.2 45.85,12.05 46.5,12.7 | v25,27 25,25.2 v23.9,24.1
  Top 1.016: 82.55,16.6 R28.1 81.55,15.2 85.5,11.25 J4.GND 87.95,12.2 v88.4,12.2 | 82.65,16.6 v82.7,16.6 | J2.GND 37.5,11.65 40.3,11.65 | J1.GND 16.57,6.69 J1.SHLD1 | J3.GND 62.95,10.8 64.1,10.8 v64.1,10.2 | 40.3,11.65 41.85,11.65 v42.9,12.7 46.5,12.7 v47.3,12.7 47.3,16 v47.1,16.2 | 40.3,11.65 40.7,11.25 v40.7,10 | v48.4,27 49.9,28.5 51.3,29.9 v51.3,33.8 | v37.3,47.6 38.5,47.6 39,48.1 v40,48.1
  Top 1.27: POWER.2 60,45.3 59.9,45.2
  Bottom 0.152: v20.5,12.9 18.38,15.02 18.38,16.94 17.18,18.14 17.18,28.34 16.84,28.68 16.36,28.68 16.02,28.34 16.02,27.86 16.19,27.68 16.19,10.02 17.27,8.95 18.43,8.95 18.55,9.07 18.55,10.55 v18.8,10.8
  Bottom 0.305: USBIN.GND 50.35,36.03 46.54,32.22 42.92,32.22 v42.8,32.1
  Bottom 0.406: U$3.4 11.55,10.45 11,9.9 11,6.85 C5.2 | C8.1 2.65,6.32 J1.SHLD2 | C9.1 26.65,6.32 J2.SHLD2 | C10.1 50.65,5.92 J3.SHLD2 | C12.1 74.65,6.32 J4.SHLD2 | U$4.4 35.35,10.45 35,10.1 35,6.95 C6.2 | U$5.4 59.05,10.45 58.6,10 58.6,6.75 C7.2 | U$8.4 83.05,10.45 82.5,9.9 82.5,7.05 C11.2 | R8.2 R7.2 | RN1.1 RN1.2 RN1.3 RN1.4 | 29.95,51.35 FLASH.2 | IC12.9 40.28,48.18 USBIN.MT1 | POWER.2 60,51.9 58.7,53.2 | RN2.5 23.07,43.38 v23.6,43.9
  Bottom 0.61: RN1.4 36.12,48.77 v37.3,47.6
  Bottom 0.813: PROGRAMMING.3 18.37,52.07 19.3,53 29.9,53 | OLED.1 33.49,53 29.9,53 | 29.9,53 29.95,52.95 29.95,51.35 | J3.SHLD1 64.57,9.73 v64.1,10.2 | v40.7,10 40.7,5.67 J2.SHLD1
  Bottom 1.27: J8.2 92.7,2.7 v92.3,2.3 91.81,2.3 J4.SHLD1 88.56,5.55 C11.2 | C13.2 6.44,5.54 J1.SHLD2 | C5.2 16.38,5.35 J1.SHLD1 19.71,2.4 v20.2,2.4 20.5,2.7 J5.2 24.59,2.7 J2.SHLD2 30.44,5.54 C14.2 | C17.2 53.84,5.14 J3.SHLD2 48.99,2.7 J6.2 44.7,2.7 v44.3,2.3 43.81,2.3 J2.SHLD1 40.38,5.35 C6.2 | C7.2 64.36,5.35 J3.SHLD1 67.41,2.3 v68.3,2.3 68.7,2.7 J7.2 72.59,2.7 J4.SHLD2 75.99,6.1 C18.2 | USBIN.MT2 53.41,53.31 58.59,53.31 58.7,53.2 58.7,52.71 59.52,51.9 59.52,51.48 POWER.2
  pour Bottom: 0,3 0,52 arc-90 3,55 4,55 97,55 arc-90 100,52 100,3 arc-90 97,0 96,0 3,0 arc-90
INTERUPT  (via drill 0.35)
  Top 0.406: IC7.IO2 20.2,46.04 v20.2,43.6
  Bottom 0.406: RN2.3 21.17,42.03 20.1,43.1 20.1,43.5 v20.2,43.6 20.2,43.8 26,49.6 36.5,49.6 39.01,47.09 IC12.8
IO12  (via drill 0.35)
  Top 0.152: IC6.3 12.18,12.85 v11.9,12.57 | IC6.7 15.97,13.15 v17.6,11.52 | v17.8,16.7 16.68,16.7 16.63,16.65 11.45,16.65 11.3,16.5 11.3,14.1 11.4,14 v11.5,14
  Top 0.406: IC7.IO12 20.37,33.02 v20.29,33.1
  Bottom 0.127: RN3.3 20.32,37.72 19.94,38.1 19.18,38.1 18.92,37.85 18.92,34.29 17.14,32.51 9.53,32.51 8.89,31.88 8.89,23.88 13.08,19.68 13.08,15.62 11.56,14.1 v11.5,14
  Bottom 0.152: v17.6,11.52 17.56,11.52 17.02,12.06 17.02,15.91 v17.8,16.7 | v11.5,14 11.9,13.6 v11.9,12.57
  Bottom 0.406: v20.29,33.1 RN3.3
IO13  (via drill 0.35)
  Top 0.127: v27.55,18.67 26.85,19.37 25.24,19.37 v25.18,19.43 | v25.68,23.46 25.98,23.76 25.98,26.7 26.67,27.39 26.67,28.62 25.52,29.77 23.52,29.77 22.37,30.92 IC7.IO13
  Top 0.152: IC13.7 32.85,13.05 33,13.2 33,13.63 v32.46,14.16 | IC13.3 31.25,12.75 v30.9,12.4
  Top 0.406: v21.91,33.21 21.91,31.67 IC7.IO13
  Bottom 0.127: 32.01,13.71 27.55,18.17 v27.55,18.67 | v25.68,23.46 24.78,22.56 24.78,19.83 v25.18,19.43
  Bottom 0.152: v30.9,12.4 30.9,12.6 32.01,13.71 v32.46,14.16
  Bottom 0.406: RN3.2 21.09,34.04 v21.91,33.22 v21.91,33.21
IO14  (via drill 0.35)
  Top 0.127: v27.77,14.4 28.22,14.4 29.03,15.21 29.03,16.26 28.75,16.54 25.5,16.54 v25.4,16.64 | v18.03,29.21 18.03,30.86 18.29,31.11 IC7.IO14
  Top 0.152: IC14.3 58.63,12.43 58.32,12.43 58.06,12.17 v57.85,12.17 | IC14.7 60.65,12.75 60.9,13 60.9,13.7 60.3,14.3 v60.1,14.3
  Top 0.406: v18.89,32.99 18.89,31.73 IC7.IO14
  Bottom 0.127: v27.77,14.4 28.27,14.9 30.03,14.9 30.61,14.32 30.61,13.59 27.43,10.41 27.43,8.51 28.07,7.87 31.24,7.87 37.85,1.27 51.94,1.27 58.04,7.37 58.04,10.79 57.66,11.18 57.66,11.56 57.78,11.68 57.78,12.06 v57.85,12.17 | v25.4,16.64 25.4,17.27 17.65,25.02 17.65,28.83 v18.03,29.21
  Bottom 0.152: v60.1,14.3 59.98,14.3 v57.85,12.17
  Bottom 0.406: RN3.4 19.49,33.85 18.89,33.26 v18.89,32.99
IO15  (via drill 0.35)
  Top 0.127: v82.8,5.59 85.98,5.59 87.88,7.49 90.93,7.49 91.69,6.73 96.52,6.73 97.16,7.37 98.17,7.37 98.3,7.49 98.3,9.41 93.81,13.9 93.81,22.97 82.68,34.1 82.68,35.55 80.38,37.85 42.21,37.85 40.05,40.01 v39.75,40.01 | v32.53,41.24 29.99,41.24 v29.39,40.64
  Top 0.152: IC15.3 79.63,12.93 79.32,12.93 78.99,12.6 v78.3,12.6 | IC15.7 80.97,13.25 v81.25,13.53
  Top 0.406: IC7.IO15 22.3,46.14 v22.3,44.1
  Bottom 0.127: v82.8,5.59 82.04,6.35 82.04,10.92 80.39,12.57 80.31,12.6 | v39.75,40.01 33.77,40.01 v32.53,41.24 | v29.39,40.64 29.29,40.54 28.09,40.54 24.05,44.58 22.86,44.58 22.48,44.2 v22.3,44.1
  Bottom 0.152: v81.25,13.53 80.31,12.6 v78.3,12.6
  Bottom 0.406: RN2.4 21.82,43.62 v22.3,44.1
N$3
  Top 0.254: C25.1 69.64,23.37 Y2.1 65.31,27.7 51.04,27.7 IC5.30
N$4
  Top 0.254: R15.2 C24.1 41.65,26.5 43.03,26.5 44.13,25.4 45.15,25.4 IC5.4
N$5
  Top 0.254: 58.51,25.2 56.66,23.35 53.7,23.35 | 53.7,23.35 C26.1 | 53.7,23.35 53.7,24.3 R16.1 58.51,25.2 | 58.51,25.2 Y2.2
N$7
  Top 0.254: R16.2 50.45,26.4 IC5.29
N$9
  Top 0.406: NEOPIXEL1.2 22.8,5.5 24.5,5.5 25,5 25,4.6 28.2,1.4 45.9,1.4 47.7,3.2 NEOPIXEL2.4
N$10
  Top 0.406: NEOPIXEL2.2 46.7,5.6 48.2,5.6 48.7,5.1 48.7,3.5 49.6,2.6 66.2,2.6 67.4,1.4 70.6,1.4 71.7,2.5 NEOPIXEL3.4
N$11
  Bottom 0.406: U$3.5 12.45,9.5 12.85,9.1 | R9.1 12.86,27.64 IC1.7
  Bottom 1.27: U$3.6 12.85,9.1 13.2,9.1 13.5,8.8 | 13.5,8.8 13.57,8.73 14.69,9.85 | C5.1 13.5,8.05 13.5,8.8
  Bottom 2.54: 14.69,9.85 14.69,20.15 10.43,24.4 R9.1
N$12
  Bottom 0.406: U$4.5 36.45,9.5 36.85,9.1 | IC2.7 31.03,27.64 R10.1
  Bottom 1.27: U$4.6 36.85,9.1 37.2,9.1 | 37.2,9.1 37.2,7.65 C6.1 | 38.6,10.5 37.2,9.1
  Bottom 2.54: R10.1 28.5,24.1 31.6,21 33.8,21 38.6,16.2 38.6,10.5
N$13
  Bottom 0.406: IC3.2 63.79,27.7 R30.1
N$14
  Bottom 0.406: R12.1 39.05,28.91 IC2.1
N$15
  Bottom 0.406: IC1.1 21.75,28.91 R7.1
N$16
  Bottom 0.406: IC1.2 20.91,27.64 R8.1
N$17  (via drill 0.35)
  Top 0.406: NEOPIXEL1.4 22.8,4 20.8,6 v20.4,6
  Bottom 0.406: R6.1 19.55,6.85 v20.4,6
N$19
  Bottom 0.406: U$5.5 59.9,9.5 60.15,9.25 60.15,8.9 | IC3.7 56.53,27.64 R11.1
  Bottom 1.27: U$5.6 60.15,8.9 60.6,8.9 | 60.6,8.9 60.6,9 62.2,10.6 | 60.6,8.9 60.6,7.65 C7.1
  Bottom 2.54: R11.1 54,24.1 62.2,15.9 62.2,10.6
N$20
  Top 0.406: NEOPIXEL3.2 70.8,5.5 72.5,5.5 72.9,5.1 72.9,3.6 74.5,2 89.8,2 90.58,1.22 94.22,1.22 95.7,2.7 NEOPIXEL4.4
N$21  (via drill 0.35)
  Top 1.27: v52.6,10.7 53.95,9.35 J3.VBUS 55.5,10.35 v55.5,10.7
  Bottom 0.406: U$5.2 56.75,9.05 56.75,9
  Bottom 1.27: U$5.1 56.75,9 C17.1 | C17.1 C10.2 52.6,9.25 v52.6,10.7 | v55.5,10.7 55.5,9.6 C17.1
N$22  (via drill 0.35)
  Top 1.27: v28.9,10.3 29.45,9.75 J2.VBUS 31.35,10.6 v31.5,10.6
  Bottom 0.406: U$4.2 33.7,9.25 33.35,8.9
  Bottom 1.27: U$4.1 33.35,8.9 C14.1 | C14.1 30.9,9 C9.2 28.9,9.55 v28.9,10.3 | v31.5,10.6 31.5,9.4 C14.1
N$25
  Bottom 0.406: U$8.5 83.8,9.45 84.25,9 | IC4.7 81.83,27.64 R14.1
  Bottom 1.27: U$8.6 84.25,9 84.7,9 | 84.7,9 84.7,7.95 C11.1 | 86,10.3 84.7,9
  Bottom 2.54: R14.1 79.5,23.9 86,17.4 86,10.3
N$26  (via drill 0.35)
  Top 1.27: v76.8,10.6 77.65,9.75 J4.VBUS 79.35,10.6 v79.5,10.6
  Bottom 0.406: U$8.2 80.85,9.15 80.85,8.9
  Bottom 1.27: U$8.1 80.85,8.9 C18.1 | C18.1 78.9,9 C12.2 76.35,10.15 v76.8,10.6 | v79.5,10.6 79.5,9.4 C18.1
N$41  (via drill 0.35)
  Top 1.27: v4.8,10.7 5.75,9.75 J1.VBUS 7.5,10.75 v7.5,10.9
  Bottom 1.016: U$3.2 9.7,9.25 9.35,8.9
  Bottom 1.27: U$3.1 9.35,8.9 C13.1 | C13.1 6.9,9 C8.2 4.8,9.45 v4.8,10.7 | v7.5,10.9 7.5,9.4 C13.1
NEOPIXEL  (via drill 0.35)
  Top 0.406: IC7.IO0 18.37,44.57 v18.3,44.5 | v16.6,28.1 17.04,28.54 17.04,29.25 17.4,29.61 17.4,32.54 16.57,33.37 v16.5,33.37
  Bottom 0.406: FLASH.1 18.3,46.01 v18.3,44.5 18.3,42.1 18.95,41.45 | v16.5,33.37 16.8,33.67 16.8,39.3 18.95,41.45 | 18.95,41.45 19.17,41.23 RN2.2 | v16.6,28.1 16.6,10.95 R6.2
RST  (via drill 0.35)
  Top 0.406: v36.4,43.9 27.17,34.67 18.55,34.67 v17.96,35.26 17.46,35.26 17.07,34.87 11.72,34.87 10.37,33.52 IC7.RST 8.88,29.73 v7.55,29.73
  Bottom 0.406: RN2.1 21.43,40.03 19.03,40.03 18.06,39.06 18.06,35.36 v17.96,35.26 | v7.55,29.73 4.93,27.1 RESET.1 | v36.4,43.9 36.4,45.6 IC12.6
RX
  Top 0.406: IC7.RXD/IO3 12.37,50.94 PROGRAMMING.2
S1+
  Top 0.152: IC11.8 18.66,11.62 17.76,10.72 17.18,10.72 15.95,11.95 15.95,12.55 15.65,12.85 IC6.6
  Top 0.305: R3.2 18.85,14.5 20.2,14.5 21.2,13.5 21.2,12.5 20.32,11.62 IC11.8
  Top 0.406: R3.2 17.7,15.65 R2.2
S1-
  Top 0.152: IC6.1 14.15,13.45 13.85,13.75 13.85,15.6
  Top 0.305: R1.2 15.25,14.3 17.2,14.3 17.9,13.6 17.9,13.2 18.18,12.93 IC11.6
  Top 0.406: R4.2 13.85,15.6 R1.2
S2+
  Top 0.152: IC13.6 32.47,12.77 32.97,12.77 33.3,13.11 33.3,14.3 31.95,15.65 31.8,15.65
  Top 0.305: IC11.4 28.02,13.57 R17.2
  Top 0.406: R17.2 31.8,15.65 R18.2
S2-
  Top 0.152: IC13.1 28.45,13.35 27.48,12.38 25.04,12.38 IC11.2 24.91,12.3
  Top 0.305: R19.2 24.95,14.3 23.4,14.3 22.8,13.7 22.8,12.8 23.3,12.3 24.91,12.3
  Top 0.406: R19.2 27.95,15.6 R13.2
S3+
  Top 0.152: IC14.6 60.85,12.45 61.67,11.62 IC10.8
  Top 0.305: IC10.8 68.62,11.62 69.1,12.1 69.1,13.4 68,14.5 66.8,14.5 65.75,15.55 R24.2
  Top 0.406: R23.2 65.7,15.65 R24.2
S3-
  Top 0.127: IC10.6 67.06,12.95 64.52,12.95 61.98,15.49 R20.2
  Top 0.152: IC14.1 58.65,13.75 60.15,15.25 R25.2
  Top 0.406: R25.2 61.85,15.6 R20.2
S4+
  Top 0.152: IC15.6 81.95,12.95 82.2,13.2 82.2,13.4 80,15.6 R28.2
  Top 0.305: IC10.4 74.08,13.57 75.1,14.6 77.3,14.6 78.1,15.4 R27.2
  Top 0.406: R27.2 79.8,15.65 R28.2
S4-
  Top 0.152: IC10.2 73.88,12.28 75.15,13.55 IC15.1
  Top 0.305: IC10.2 71.03,12.28 70.8,12.5 70.8,13.6 71.6,14.4 73.1,14.4 74.25,15.55 R29.2
  Top 0.406: R29.2 74.3,15.65 R26.2
SCL  (via drill 0.35)
  Top 0.254: IC7.IO5 14.43,46.33 15.65,47.55 21.13,47.55 21.34,47.35 21.34,44.09 22.35,43.08 23.77,43.08 24.79,44.09 24.79,44.5 28.85,48.56 v32.31,48.56 34.95,48.56 38.81,52.43 OLED.3 39.01,52.63 40.23,53.85 42.06,53.85 42.68,53.23 60.66,53.23 v75.26,38.63 | v18.29,25.2 13.41,30.07 v13.41,33.53
  Top 0.406: v14.3,44.2 14.3,46.21 IC7.IO5
  Bottom 0.254: 84.53,28.25 85.06,28.25 86.98,30.17 89.41,30.17 90.41,29.16 90.41,26.01 89.61,25.2 88.8,25.2 IC4.4 | 84.53,28.25 79.86,28.25 76.81,25.2 63.8,25.2 IC3.4 | IC2.4 37.8,25.2 38.2,25.2 38.81,25.81 38.81,28.25 30.89,28.25 29.46,26.82 27.64,26.82 25.81,25 19.72,25 IC1.4 19.51,25.2 v18.29,25.2 | v32.31,48.56 30.28,46.53 30.28,45.72 IC12.1 | v13.41,33.53 13.41,39.83 12.8,40.44 12.8,41.86 13.61,42.67 R21.1 | 84.53,28.25 84.53,29.36 v75.26,38.63
  Bottom 0.406: v14.3,44.2 14.1,44 14.1,43.15 R21.1
SDA  (via drill 0.35)
  Top 0.254: OLED.4 41.13,52.6 36.08,47.55 v32.31,47.55 27.43,42.67 19.1,42.67 17.48,44.3 16.46,44.3 v16.1,44.2 | 33.33,27.73 v28.86,27.73 | v35.76,26.82 34.95,27.64 33.33,27.64 33.33,27.73 | v76.2,22.35 76.4,22.15 84.63,22.15 v85.03,22.55 | 33.33,27.73 v33.33,32.92
  Top 0.406: IC7.IO4 16.37,44.47 v16.1,44.2
  Bottom 0.254: v32.31,47.55 31.5,46.74 31.5,45.72 IC12.2 31.5,45.52 31.5,39.22 33.33,37.39 33.33,34.75 33.12,34.54 33.12,33.93 33.33,33.73 v33.33,32.92 | v28.86,27.73 27.24,27.73 25.31,25.81 21.13,25.81 20.73,26.21 19.71,26.21 IC1.3 | 36.58,26.82 37.19,26.82 37.59,26.42 IC2.3 | 36.58,26.82 v35.76,26.82 | 62.59,26.21 61.96,26.21 59.73,23.98 57.7,23.98 56.8,24.89 56.8,26.52 57.3,27.03 59.33,27.03 59.33,28.25 53.66,28.25 52.02,26.61 52.02,20.33 48.97,17.28 44.88,17.28 44.86,17.34 38.9,23.3 37.96,23.3 36.58,24.69 36.58,26.82 | 62.59,26.21 63.6,26.21 IC3.3 | v85.03,22.55 85.03,23.35 87.89,26.21 88.59,26.21 IC4.3 | v76.2,22.35 73.97,24.59 64.82,24.59 64.62,24.38 62.79,24.38 62.59,24.59 62.59,26.21
  Bottom 0.406: v16.1,44.2 16.1,43.05 R22.1
TX
  Top 0.406: IC7.TXD/IO1 10.37,51.48 PROGRAMMING.1
VCC  (via drill 0.35)
  Top 0.152: v29.7,13.93 31.87,13.93 32.05,13.75 IC13.8 | v27.4,11.59 27.05,11.24 27.05,9.85 | IC6.8 16.65,13.45 v17.7,12.4 | IC14.8 59.7,13.4 v60.1,13.4 | v60.1,11.7 60.1,6.5 | IC15.8 80.35,14.05 v80.1,14.3 | v83.84,16.54 90.06,16.54 90.2,16.4
  Top 0.254: v44.9,19.9 45.1,20.1 45.56,20.1 IC5.14 | v50.5,20.5 50.1,20.9 50.1,21.16 IC5.22 | IC5.10 43.93,21.3 v43.6,21.3 42.6,22.3 R15.1 | IC5.18 49,19.43 v49,19 | C27.1 44.76,26.5 IC5.3 | IC5.25 51,24.12 v51,24.5 50.67,24.5 IC5.26
  Top 0.305: C27.1 44.4,26.5 44.6,26.7 v44.6,27.9 | v46.81,27.9 46.81,29.86 R5.1
  Top 0.406: v43.6,21.3 36.3,21.3 | 36.3,21.3 20.9,21.3 18.6,23.6 v14.7,23.6 | 36.3,21.3 33.92,23.68 v33.92,23.82 | C36.1 84.35,23.9 83.9,23.9 v83.8,23.8 | v73.1,28.2 74.65,29.75 IC8.4 | IC7.EN 14.37,33.1 14.82,33.55 v15.18,33.55 15.73,34.1 23.11,34.1 v23.91,33.3 24.37,32.84 IC7.VCC
  Top 0.813: C16.2 79.05,27.9 | 79.05,27.9 IC8.2 | C15.2 77.25,26.1 79.05,27.9 | 79.05,27.9 76.75,30.2 | IC8.4 76.75,30.2 | 76.75,30.2 IC8.2 | IC8.2 85.95,25.6 C36.1 90.2,21.45 90.2,16.4 90.2,11.1 | NEOPIXEL2.1 47.7,9.95 47.65,10 | 90.2,11.1 95.3,11.1 95.7,10.7 NEOPIXEL4.1 95.85,8.15 C19.1 | 90.2,11.1 90.2,11 85.7,6.5 78.8,6.5 75.45,9.85 73.6,8 NEOPIXEL3.1 70.85,8.85 C4.1 65.6,9.9 62.2,6.5 60.1,6.5 54.3,6.5 49.6,11.2 | v49,19 49.6,18.4 49.6,11.2 | 47.65,10 43.7,10 42.1,8.4 39.7,8.4 37.9,6.6 30.3,6.6 27.05,9.85 23.7,9.85 C2.1 23.7,9.75 NEOPIXEL1.1 | 47.65,10 47.55,10.1 C3.1 49.6,11.2
  Top 1.016: IC8.4 57.7,30.2 52.4,35.5 33.8,35.5 | 33.8,35.5 30.92,35.5 v30,34.58 26.63,31.21 IC7.VCC | v40.4,50.4 41.8,49 41.8,43.5 33.8,35.5
  Bottom 0.152: v29.7,13.93 27.4,11.63 v27.4,11.59 26.83,11.59 23.13,7.9 20.87,7.9 20.75,8.02 20.75,9.84 18.19,12.4 v17.7,12.4 | v60.1,13.4 v60.1,11.7 | v83.84,16.54 83.84,16.44 81.7,14.3 v80.1,14.3
  Bottom 0.254: v49,19 v50.5,20.5 51,21 v51,24.5
  Bottom 0.305: v46.81,27.9 v44.6,27.9 44.6,22.3 v43.6,21.3
  Bottom 0.406: v49,19 48.3,18.3 46.5,18.3 v44.9,19.9 43.6,21.2 v43.6,21.3 | v14.7,23.6 14.18,24.12 IC1.5 | IC2.5 32.44,24.93 32.77,24.93 33.88,23.82 v33.92,23.82 33.92,26.43 35.13,27.64 IC2.2 | IC3.5 58.29,25.08 59.3,25.08 63.12,28.91 IC3.1 72.39,28.91 v73.1,28.2 | IC4.5 83.28,24.32 v83.8,23.8 86.2,26.2 86.2,27.6 86.23,27.64 | RN3.5 RN3.6 RN3.7 RN3.8 23.07,39.96 RN2.8 | RN2.8 RN2.7 RN2.6 | R21.2 15.2,41.05 | 15.2,41.05 R22.2 | v23.91,33.3 23.07,34.13 RN2.8 | 15.2,41.05 15.2,33.57 v15.18,33.55 | 86.23,27.64 IC4.2 | 86.23,27.64 87.5,28.91 IC4.1
  Bottom 0.508: v30,34.58 30,36.2 IC12.18
  Bottom 1.016: OLED.2 36.43,52.2 38.23,50.4 v40.4,50.4
VIN  (via drill 0.35)
  Top 0.406: v77.4,32.3 77.4,34.85 C21.1 C22.1
  Top 1.27: v77.4,32.3 77.59,32.49 IC8.3
  Bottom 0.406: IC1.8 14.18,30.97 14.2,31 | IC2.8 32.27,30.98 32.3,31 | IC3.8 58.27,31.07 58.3,31.1 | IC4.8 81.69,28.91 R14.2
  Bottom 1.27: 77.5,31.1 77.4,31.2 v77.4,32.3
  Bottom 2.54: R9.2 14.2,31 28.4,31 R10.2 28.6,31 32.3,31 39.64,31 40.44,30.2 53.3,30.2 R11.2 54.2,31.1 54.66,31.1 | R14.2 77.5,31.1 58.3,31.1 54.66,31.1 | POWER.1 57.46,33.9 54.66,31.1

### Text on the board
tPlace: SCL | SDA | + | TX | RX | + | V0.0.0 | Austins Creations / Smart USB Hub | 10uF | 22pf | 1.5k | 22pf | AMS1117-3.3v | 6MHZ | SN75240 | 1000uf | 1.5k | 10uF | 27pf | 27pf | 15k | 27Ω | 27Ω | 27Ω | 27Ω | 22pf | 22pf | 22pf | 22pf | 22pf | 22pf | 15k | 74LVC2G66 | 15k | 15k | 15k | 15k | 15k | 74LVC2G66 | 74LVC2G66 | 74LVC2G66 | SN75240 | SN75240
bPlace: - + | MCP23008 | 4.7k | INA219 | INA219 | INA219 | INA219 | 10k | 10k | 10k | 0.1Ω | 0.1Ω | 0.1Ω | 0.1Ω | SIP32508 | SIP32508 | SIP32508 | SIP32508 | 470Ω | 4.7uF | 4.7uF | 4.7uF | 4.7uF | 100uF / TANTALUM | 100uF / TANTALUM | 100uF / TANTALUM | 100uF / TANTALUM